# Altium schematic sheet Sheet2.SchDoc
size A4
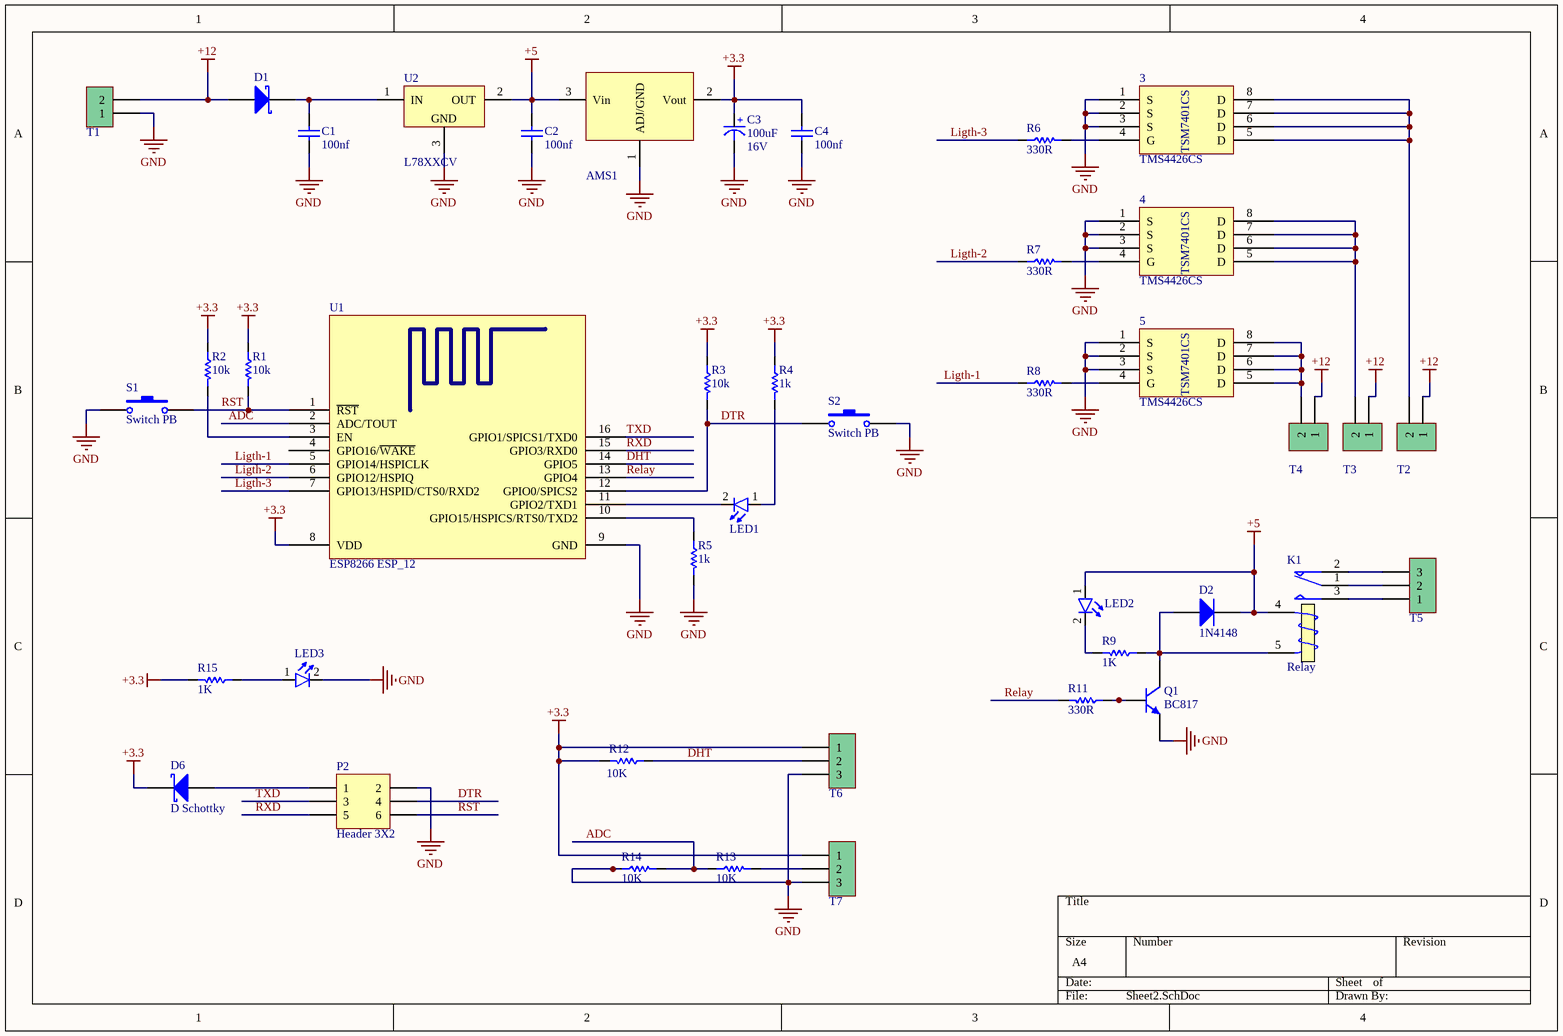
[diagram p0: Sheet2.SchDoc]

## Parts
3  TMS4426CS  [sop8]
4  TMS4426CS  [sop8]
5  TMS4426CS  [sop8]
AMS1  AMS1117  [AMS1117]  (value not drawn)
C1  value 100nf  [C1206]  (hidden comment: Cap Semi)
C2  value 100nf  [C1206]  (hidden comment: Cap Semi)
C3  Voltage: 16V  [cap 02]  (hidden comment: 100uF)
C4  value 100nf  [C1206]  (hidden comment: Cap Semi)
D1  (no value)  [SMB]
D2  1N4148  [SMB]
D6  D Schottky  [SMB]
K1  Relay  [Relay 18.85x15.35x15.70]
LED1  Red  [LED-3mm]  (value not drawn)
LED2  Red  [LED-3mm]  (value not drawn)
LED3  Red  [LED-3mm]  (value not drawn)
P2  Header 3X2  [HDR2X3]
Q1  BC817  [SOT23_BEC_N]
R1  10k  [RES 1206 (3216X08L)]
R2  10k  [RES 1206 (3216X08L)]
R3  10k  [RES 1206 (3216X08L)]
R4  1k  [RES 1206 (3216X08L)]
R5  1k  [RES 1206 (3216X08L)]
R6  330R  [RES 1206 (3216X08L)]
R7  330R  [RES 1206 (3216X08L)]
R8  330R  [RES 1206 (3216X08L)]
R9  1K  [RES 1206 (3216X08L)]
R11  330R  [RES 1206 (3216X08L)]
R12  10K  [RES 1206 (3216X08L)]
R13  10K  [RES 1206 (3216X08L)]
R14  10K  [RES 1206 (3216X08L)]
R15  1K  [RES 1206 (3216X08L)]
S1  Switch PB  [button_R]
S2  Switch PB  [button_R]
T1  Phoenix terminal  [phoenix terminal 2]  (value not drawn)
T2  Phoenix terminal  [phoenix terminal 2]  (value not drawn)
T3  Phoenix terminal  [phoenix terminal 2]  (value not drawn)
T4  Phoenix terminal  [phoenix terminal 2]  (value not drawn)
T5  Phoenix terminal  [phoenix terminal 3]  (value not drawn)
T6  Phoenix terminal  [phoenix terminal 3]  (value not drawn)
T7  Phoenix terminal  [phoenix terminal 3]  (value not drawn)
U1  ESP8266 ESP_12  [ESP8266 ESP_12]
U2  L78XXCV  [78XXCV - Right]

## Nets
+3.3: AMS1.2(Vout) C3.1(+) C4.2 D6.2(K) R1.1 R2.1 R3.1 R4.1 R12.2 R15.2 T6.1 T7.1 U1.8(VDD)
+5: AMS1.3(Vin) C2.2 D2.2(K) K1.4(T1) LED2.1(A) U2.2(OUT)
+12: D1.1(A) T1.2 T2.1 T3.1 T4.1
GND: 3.1(S) 3.2(S) 3.3(S) 4.1(S) 4.2(S) 4.3(S) 5.1(S) 5.2(S) 5.3(S) AMS1.1(ADJ/GND) C1.1 C2.1 C3.2(-) C4.1 LED3.2(K) P2.2 Q1.2(E) R5.2 R14.1 S1.1 S2.2 T1.1 T6.3 T7.3 U1.9(GND) U2.3(GND)
ADC: R13.1 R14.2 U1.2(ADC/TOUT)
DHT: R12.1 T6.2 U1.14(GPIO5)
DTR: P2.4 R3.2 S2.1 U1.12(GPIO0/SPICS2)
Ligth-1: R8.1 U1.5(GPIO14/HSPICLK)
Ligth-2: R7.1 U1.6(GPIO12/HSPIQ)
Ligth-3: R6.1 U1.7(GPIO13/HSPID/CTS0/RXD2)
Relay: R11.2 U1.13(GPIO4)
RST: P2.6 R1.2 S1.2 U1.1(~{RST})
RXD: P2.5 U1.15(GPIO3/RXD0)
TXD: P2.3 U1.16(GPIO1/SPICS1/TXD0)
Net3_4: 3.4(G) R6.2
Net3_5: 3.5(D) 3.6(D) 3.7(D) 3.8(D) T2.2
Net4_4: 4.4(G) R7.2
Net4_5: 4.5(D) 4.6(D) 4.7(D) 4.8(D) T3.2
Net5_4: 5.4(G) R8.2
Net5_5: 5.5(D) 5.6(D) 5.7(D) 5.8(D) T4.2
NetC1_2: C1.2 D1.2(K) U2.1(IN)
NetD2_1: D2.1(A) K1.5(T2) Q1.3(C) R9.1
NetD6_1: D6.1(A) P2.1
NetK1_1: K1.1(COM) T5.2
NetK1_2: K1.2(NC) T5.3
NetK1_3: K1.3(NO) T5.1
NetLED1_1: LED1.1(A) R4.2
NetLED1_2: LED1.2(K) U1.11(GPIO2/TXD1)
NetLED2_2: LED2.2(K) R9.2
NetLED3_1: LED3.1(A) R15.1
NetQ1_1: Q1.1(B) R11.1
NetR2_2: R2.2 U1.3(EN)
NetR5_1: R5.1 U1.10(GPIO15/HSPICS/RTS0/TXD2)
NetR13_2: R13.2 T7.2

Not connected (* = marked no-connect by the designer): U1 4(GPIO16/~{WAKE})

## Notes on the sheet
- (in symbol TMS4426CS) TSM7401CS

## Library data of the parts
AMS1 = AMS1117: LDO 3.3V/5V/12V; pin to pad: 1>2 2>3 3>1
C1 C2 C4 = Cap Semi: Capacitor (Semiconductor SIM Model); Published: 8-Jun-2000; LatestRevisionDate: 29-May-2009; LatestRevisionNote: IPC-7351 Footprint Added.; PackageReference: C1206; Publisher: Altium Limited; PackageDescription: Chip Capacitor
C3 = Cap-Polar: Polar Capacitor; Designer: Saeid Jorablo; Organazation: ControTec; Adding Date: 1387/12/20; Value: 100uF
D1 = D Schottky: Published: 8-Jun-2000; LatestRevisionDate: 17-Jul-2002; LatestRevisionNote: Re-released for DXP Platform.; PackageReference: SMB; Publisher: Altium Limited; PackageDescription: DO-214-AA/SMB; 2 C-Bend Leads; Body 5.3 x 3.6 mm, inc. leads (LxW); Code_JEDEC: DO-214-AA
D2 = Diode 1N4148: High Conductance Fast Diode; Published: 8-Jun-2000; LatestRevisionDate: 17-Jul-2002; LatestRevisionNote: Re-released for DXP Platform.; DatasheetVersion: 1997; PackageReference: DO-35; Publisher: Altium Limited; PackageDescription: Diode, Axial; Body 3.8 x 1.9 mm (LxDia. max), Lead Dia. 0.53 mm (max); Code_JEDEC: DO-204-AH; ComponentLink1Description: Manufacturer Link; ComponentLink1URL: http://www.fairchildsemi.com/; ComponentLink2Description: Datasheet; ComponentLink2URL: http://www.fairchildsemi.com/ds/1N%2F1N4148.pdf
D6 = D Schottky: Schottky Diode; Published: 8-Jun-2000; LatestRevisionDate: 17-Jul-2002; LatestRevisionNote: Re-released for DXP Platform.; PackageReference: SMB; Publisher: Altium Limited; PackageDescription: DO-214-AA/SMB; 2 C-Bend Leads; Body 5.3 x 3.6 mm, inc. leads (LxW); Code_JEDEC: DO-214-AA
K1 = Relay: SPDT Relay; Designer: Eng. Saeid Jorablo; Company: E.P.I.L; Design_Date: 2011/10/31
LED1-LED3 = LED: Designer: Saeid Jorablo; Organazation: ControTec; Adding Date: 1387/12/22; Color: Red; Size: SMD 1206
P2 = Header 3X2: Header, 3-Pin, Dual row; LatestRevisionDate: 17-Jul-2002; LatestRevisionNote: Re-released for DXP Platform.; Publisher: Altium Limited
Q1 = NPN: NPN Bipolar Transistor; Published: 8-Jun-2000; LatestRevisionDate: 29-May-2009; LatestRevisionNote: IPC-7351 Footprint Added.; PackageVersion: Aug-1999; PackageReference: SOT-23B; Publisher: Altium Limited; PackageDescription: 3-Pin SOT-23 Package 0.95 mm Pitch, 2.4 mm Lead Span
R1-R9 R11-R15 = Resistor: Tolerance: 5%; Power: 1/8 W
  R1-R3: Value: 10k
  R4 R5: Value: 1k
  R6-R8 R11: Value: 330R
  R9 R15: Value: 1K
  R12-R14: Value: 10K
S1 S2 = Switch PB: Push Button Switch
T1 = Phoenix terminal 2: Terminal 2 Pin; pin to pad: 1>2 2>1; Designer: Seyed Mohsen Ghasemain; E-mail: picpars@gmail.com; ComponentLinkURL: www.picpars.com
T2-T4 = Phoenix terminal 2: Terminal 2 Pin; Designer: Seyed Mohsen Ghasemain; E-mail: picpars@gmail.com; ComponentLinkURL: www.picpars.com
T5-T7 = Phoenix terminal 3: Terminal 3 Pin; Designer: Seyed Mohsen Ghasemain; E-mail: picpars@gmail.com; ComponentLinkURL: www.picpars.com
U1 = ESP8266 ESP_12: ESP8266 ESP-12; IC: ESP8266-EX; Vendor: Ai-thinker; LatestReviewer: Zion Blue; Published: 14-Apr-2015; Publisher: Cynetik Group; LatestRevisionData: 14-Apr-2015; LatestRevisionNote: Include 3D body and Footprint
U2 = L78XXCV: Fixed Voltage Regulator; Designer: Saeid Jorablo; Company: ControTec; Adding Date: 1387/01/06; Voltage: *